# Altium project DC_AC_Converter.PrjPcb
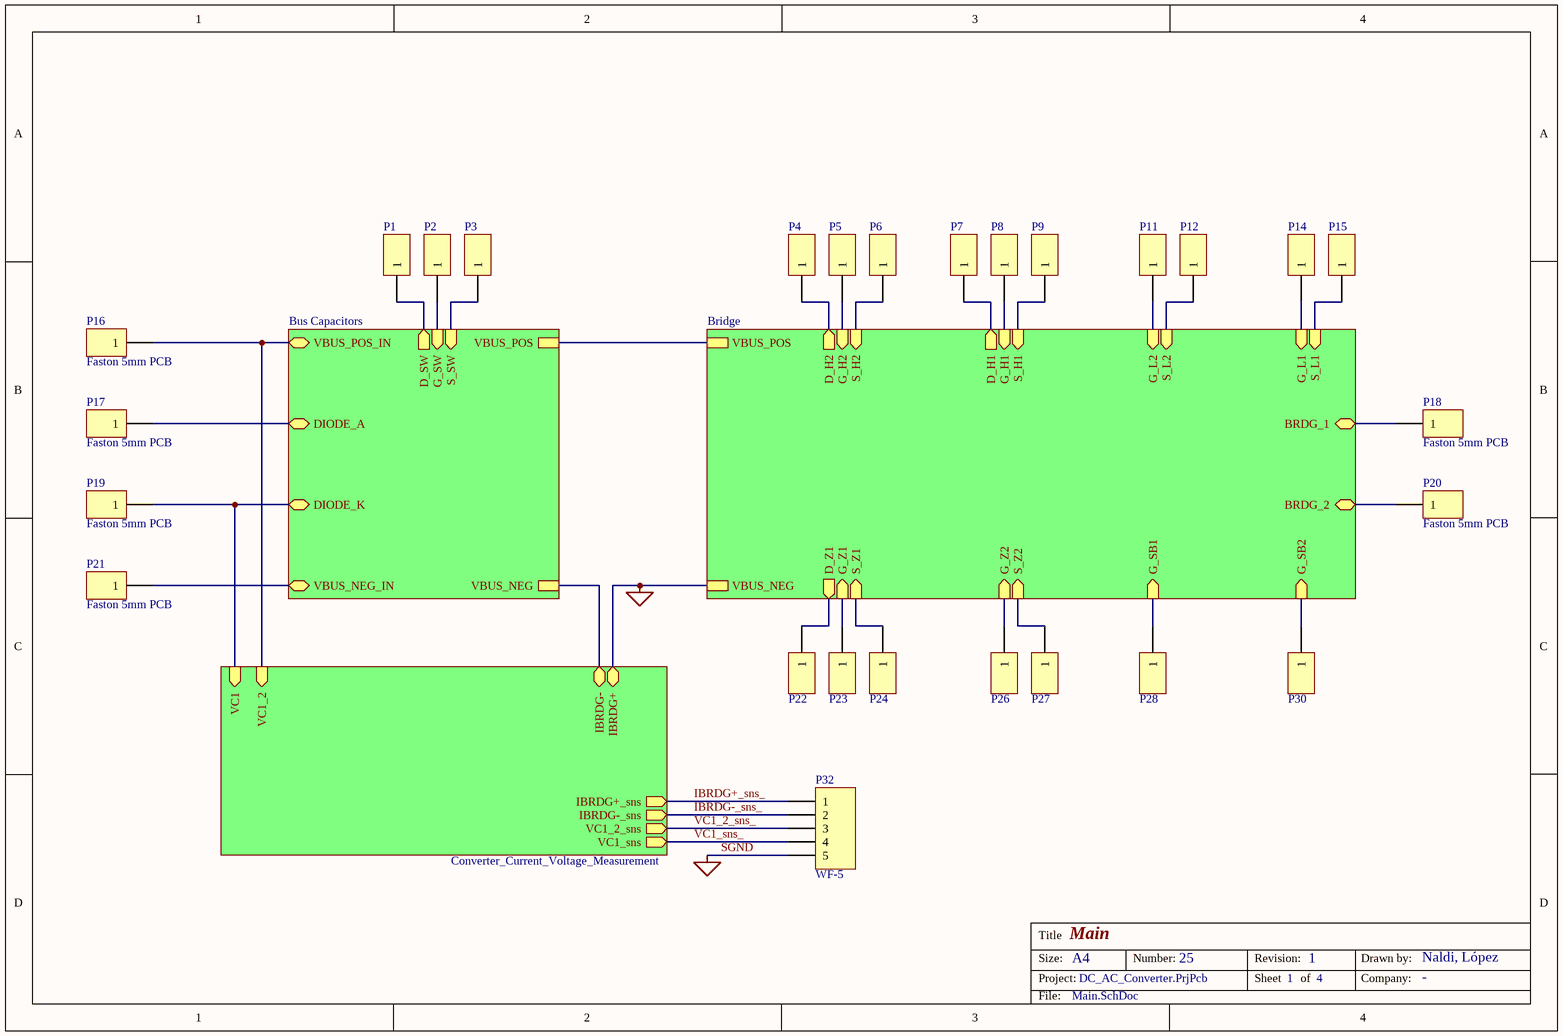
[diagram p0: Main.SchDoc]
4 sheets, 108 parts. Net scope: hierarchical (ports join the sheet entries above them; power ports are global).
Board file: DC_AC_Converter.PcbDoc
Sheets:
  Main.SchDoc
    Bus Capacitors = Bus_Capacitors.SchDoc
    Converter_Current_Voltage_Measurement = Converter_Current_Voltage_Measurement.SchDoc
    Bridge = Bridge.SchDoc

## Sheet Main.SchDoc: Main
size A4; CompanyName: -; DrawnBy: Naldi, López; Revision: 1; SheetNumber: 1; SheetTotal: 4; Number: 25

### Parts
P1  TS-101-T-AA  [SAMTEC TERMINAL/SOCKET STRIP 1 PIN new]  (value not drawn)
P2  TS-101-T-AA  [SAMTEC TERMINAL/SOCKET STRIP 1 PIN new]  (value not drawn)
P3  TS-101-T-AA  [SAMTEC TERMINAL/SOCKET STRIP 1 PIN new]  (value not drawn)
P4  TS-101-T-AA  [SAMTEC TERMINAL/SOCKET STRIP 1 PIN new]  (value not drawn)
P5  TS-101-T-AA  [SAMTEC TERMINAL/SOCKET STRIP 1 PIN new]  (value not drawn)
P6  TS-101-T-AA  [SAMTEC TERMINAL/SOCKET STRIP 1 PIN new]  (value not drawn)
P7  TS-101-T-AA  [SAMTEC TERMINAL/SOCKET STRIP 1 PIN new]  (value not drawn)
P8  TS-101-T-AA  [SAMTEC TERMINAL/SOCKET STRIP 1 PIN new]  (value not drawn)
P9  TS-101-T-AA  [SAMTEC TERMINAL/SOCKET STRIP 1 PIN new]  (value not drawn)
P11  TS-101-T-AA  [SAMTEC TERMINAL/SOCKET STRIP 1 PIN new]  (value not drawn)
P12  TS-101-T-AA  [SAMTEC TERMINAL/SOCKET STRIP 1 PIN new]  (value not drawn)
P14  TS-101-T-AA  [SAMTEC TERMINAL/SOCKET STRIP 1 PIN new]  (value not drawn)
P15  TS-101-T-AA  [SAMTEC TERMINAL/SOCKET STRIP 1 PIN new]  (value not drawn)
P16  Faston 5mm PCB  [FASTON 5mm PCB]
P17  Faston 5mm PCB  [FASTON 5mm PCB]
P18  Faston 5mm PCB  [FASTON 5mm PCB]
P19  Faston 5mm PCB  [FASTON 5mm PCB]
P20  Faston 5mm PCB  [FASTON 5mm PCB]
P21  Faston 5mm PCB  [FASTON 5mm PCB]
P22  TS-101-T-AA  [SAMTEC TERMINAL/SOCKET STRIP 1 PIN new]  (value not drawn)
P23  TS-101-T-AA  [SAMTEC TERMINAL/SOCKET STRIP 1 PIN new]  (value not drawn)
P24  TS-101-T-AA  [SAMTEC TERMINAL/SOCKET STRIP 1 PIN new]  (value not drawn)
P26  TS-101-T-AA  [SAMTEC TERMINAL/SOCKET STRIP 1 PIN new]  (value not drawn)
P27  TS-101-T-AA  [SAMTEC TERMINAL/SOCKET STRIP 1 PIN new]  (value not drawn)
P28  TS-101-T-AA  [SAMTEC TERMINAL/SOCKET STRIP 1 PIN new]  (value not drawn)
P30  TS-101-T-AA  [SAMTEC TERMINAL/SOCKET STRIP 1 PIN new]  (value not drawn)
P32  WF-5  [HDR1X5]

### Sub-sheets
Bridge = Bridge.SchDoc: BRDG_2 (bidir), BRDG_1 (bidir), VBUS_POS, VBUS_NEG, G_H2 (in), S_H2 (in), G_H1 (in), S_H1 (in), G_L2 (in), S_L2 (in), G_SB1 (in), G_SB2 (in), G_Z2 (in), S_Z2 (in), G_Z1 (in), S_Z1 (in), G_L1 (in), S_L1 (in), D_H2 (out), D_H1 (out), D_Z1 (out)
Bus Capacitors = Bus_Capacitors.SchDoc: VBUS_NEG, VBUS_POS, VBUS_POS_IN (bidir), DIODE_A (bidir), DIODE_K (bidir), VBUS_NEG_IN (bidir), G_SW (in), S_SW (in), D_SW (out)
Converter_Current_Voltage_Measurement = Converter_Current_Voltage_Measurement.SchDoc: VC1 (in), VC1_sns (out), IBRDG+_sns (out), VC1_2 (in), IBRDG- (bidir), IBRDG+ (bidir), VC1_2_sns (out), IBRDG-_sns (out)

### Nets
SGND: P12.1 P15.1 P32.5 ; sheet Converter_Current_Voltage_Measurement/IBRDG+, sheet Bridge/VBUS_NEG, sheet Bridge/S_L2, sheet Bridge/S_L1
IBRDG+_sns_: P32.1 ; sheet Converter_Current_Voltage_Measurement/IBRDG+_sns
IBRDG-_sns_: P32.2 ; sheet Converter_Current_Voltage_Measurement/IBRDG-_sns
VC1_2_sns_: P32.3 ; sheet Converter_Current_Voltage_Measurement/VC1_2_sns
VC1_sns_: P32.4 ; sheet Converter_Current_Voltage_Measurement/VC1_sns
NetC7_1: P4.1 P7.1 P16.1 ; sheet Bus Capacitors/VBUS_POS, sheet Bus Capacitors/VBUS_POS_IN, sheet Converter_Current_Voltage_Measurement/VC1_2, sheet Bridge/VBUS_POS, sheet Bridge/D_H2, sheet Bridge/D_H1
NetC7_3: P3.1 P17.1 ; sheet Bus Capacitors/DIODE_A, sheet Bus Capacitors/S_SW
NetC14_1: P1.1 P19.1 ; sheet Bus Capacitors/DIODE_K, sheet Bus Capacitors/D_SW, sheet Converter_Current_Voltage_Measurement/VC1
NetC14_3: P21.1 ; sheet Bus Capacitors/VBUS_NEG, sheet Bus Capacitors/VBUS_NEG_IN, sheet Converter_Current_Voltage_Measurement/IBRDG-
NetP2_1: P2.1 ; sheet Bus Capacitors/G_SW
NetP5_1: P5.1 ; sheet Bridge/G_H2
NetP6_1: P6.1 P20.1 P27.1 ; sheet Bridge/BRDG_2, sheet Bridge/S_H2, sheet Bridge/S_Z2
NetP8_1: P8.1 ; sheet Bridge/G_H1
NetP9_1: P9.1 P18.1 P24.1 ; sheet Bridge/BRDG_1, sheet Bridge/S_H1, sheet Bridge/S_Z1
NetP11_1: P11.1 ; sheet Bridge/G_L2
NetP14_1: P14.1 ; sheet Bridge/G_L1
NetP22_1: P22.1 ; sheet Bridge/D_Z1
NetP23_1: P23.1 ; sheet Bridge/G_Z1
NetP26_1: P26.1 ; sheet Bridge/G_Z2
NetP28_1: P28.1 ; sheet Bridge/G_SB1
NetP30_1: P30.1 ; sheet Bridge/G_SB2

### Notes on the sheet
- Title
- Size:
- Project:
- A4
- Number:
- Revision:
- Sheet
- of
- Drawn by:
- Company:
- File:

### Library data of the parts
P1-P9 P11 P12 P14 P15 P22-P24 P26-P28 P30 = TS-101-T-AA: Terminal Strip, 1-Pin, 2.54mm pitch; System: Connector; LatestRevisionDate: 17-Jul-2002; LatestRevisionNote: Re-released for DXP Platform.; Publisher: Altium Limited
P16-P21 = Faston 5mm PCB: System: Connector; LatestRevisionDate: 17-Jul-2002; LatestRevisionNote: Re-released for DXP Platform.; Publisher: Altium Limited
P32 = Header 5: Header, 5-Pin, 2.54mm pitch; System: Connector; LatestRevisionDate: 17-Jul-2002; LatestRevisionNote: Re-released for DXP Platform.; Publisher: Altium Limited

## Sheet Bus_Capacitors.SchDoc: Bus Capacitors
size A4; CompanyName: TM; DrawnBy: Juan Tinazzo; DocumentNumber: 1; Revision: 1; SheetNumber: 2; SheetTotal: 4; Number: 25
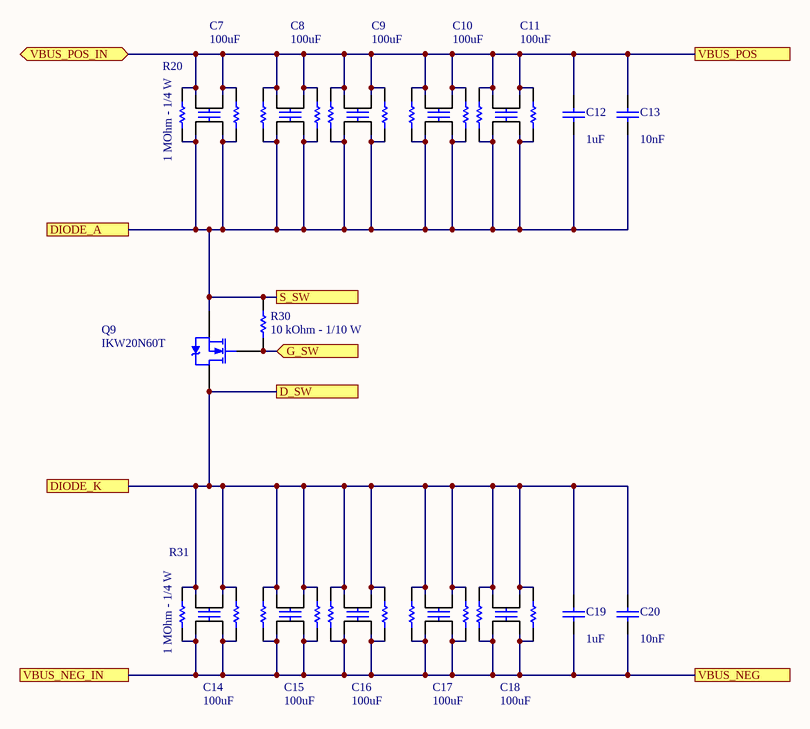
[diagram p1: Bus_Capacitors.SchDoc]

### Parts
C7  value 100uF  [MKP DC link - High density series]  (hidden comment: EPCOS B32778G4107)
C8  value 100uF  [MKP DC link - High density series]  (hidden comment: EPCOS B32778G4107)
C9  value 100uF  [MKP DC link - High density series]  (hidden comment: EPCOS B32778G4107)
C10  value 100uF  [MKP DC link - High density series]  (hidden comment: EPCOS B32778G4107)
C11  value 100uF  [MKP DC link - High density series]  (hidden comment: EPCOS B32778G4107)
C12  value 1uF  [MKP PITCH:27.5mm SIZE:13.5mmx31.5mm]  (hidden comment: EPCOS B32654A6105)
C13  value 10nF  [MKP PITCH:15mm SIZE:5mmx18mm]  (hidden comment: EPCOS B32652A0103)
C14  value 100uF  [MKP DC link - High density series]  (hidden comment: EPCOS B32778G4107)
C15  value 100uF  [MKP DC link - High density series]  (hidden comment: EPCOS B32778G4107)
C16  value 100uF  [MKP DC link - High density series]  (hidden comment: EPCOS B32778G4107)
C17  value 100uF  [MKP DC link - High density series]  (hidden comment: EPCOS B32778G4107)
C18  value 100uF  [MKP DC link - High density series]  (hidden comment: EPCOS B32778G4107)
C19  value 1uF  [MKP PITCH:27.5mm SIZE:13.5mmx31.5mm]  (hidden comment: EPCOS B32654A6105)
C20  value 10nF  [MKP PITCH:15mm SIZE:5mmx18mm]  (hidden comment: EPCOS B32652A0103)
Q9  IKW20N60T  [TO-247 Horiz. Heatsink]
R20  value 1 MOhm - 1/4 W  [RESC3216X60N]  (hidden comment: THT)
R21  THT  [RESC3216X60N]  (value not drawn)
R22  THT  [RESC3216X60N]  (value not drawn)
R23  THT  [RESC3216X60N]  (value not drawn)
R24  THT  [RESC3216X60N]  (value not drawn)
R25  THT  [RESC3216X60N]  (value not drawn)
R26  THT  [RESC3216X60N]  (value not drawn)
R27  THT  [RESC3216X60N]  (value not drawn)
R28  THT  [RESC3216X60N]  (value not drawn)
R29  THT  [RESC3216X60N]  (value not drawn)
R30  value 10 kOhm - 1/10 W  [RESC1608X50N]  (hidden comment: CRCW060310K0FKEA)
R31  value 1 MOhm - 1/4 W  [RESC3216X60N]  (hidden comment: THT)
R32  THT  [RESC3216X60N]  (value not drawn)
R33  THT  [RESC3216X60N]  (value not drawn)
R34  THT  [RESC3216X60N]  (value not drawn)
R35  THT  [RESC3216X60N]  (value not drawn)
R36  THT  [RESC3216X60N]  (value not drawn)
R37  THT  [RESC3216X60N]  (value not drawn)
R38  THT  [RESC3216X60N]  (value not drawn)
R39  THT  [RESC3216X60N]  (value not drawn)
R40  THT  [RESC3216X60N]  (value not drawn)

### Ports
D_SW, DIODE_A, DIODE_K, G_SW (in), S_SW, VBUS_NEG, VBUS_NEG_IN, VBUS_POS, VBUS_POS_IN (bidir)

### Nets
NetC7_1: C7.1 C7.2 C8.1 C8.2 C9.1 C9.2 C10.1 C10.2 C11.1 C11.2 C12.2 C13.1 R20.2 R21.2 R22.2 R23.2 R24.2 R25.2 R26.2 R27.2 R28.2 R29.2 ; port VBUS_POS_IN, port VBUS_POS
NetC7_3: C7.3 C7.4 C8.3 C8.4 C9.3 C9.4 C10.3 C10.4 C11.3 C11.4 C12.1 C13.2 Q9.3(S) R20.1 R21.1 R22.1 R23.1 R24.1 R25.1 R26.1 R27.1 R28.1 R29.1 R30.2 ; port DIODE_A, port S_SW
NetC14_1: C14.1 C14.2 C15.1 C15.2 C16.1 C16.2 C17.1 C17.2 C18.1 C18.2 C19.2 C20.2 Q9.2(D) R31.2 R32.2 R33.2 R34.2 R35.2 R36.2 R37.2 R38.2 R39.2 R40.2 ; port DIODE_K, port D_SW
NetC14_3: C14.3 C14.4 C15.3 C15.4 C16.3 C16.4 C17.3 C17.4 C18.3 C18.4 C19.1 C20.1 R31.1 R32.1 R33.1 R34.1 R35.1 R36.1 R37.1 R38.1 R39.1 R40.1 ; port VBUS_NEG, port VBUS_NEG_IN
NetP2_1: Q9.1(G) R30.1 ; port G_SW

### Notes on the sheet
- Title
- Size:
- Project:
- A4
- Number:
- Revision:
- Sheet
- of
- Drawn by:
- Company:
- File:

### Library data of the parts
C7-C11 C14-C18 = EPCOS B32778G4107: MKP DC link - High density series - 100uF 450V; Published: 8-Jun-2000; LatestRevisionDate: 17-Jul-2002; LatestRevisionNote: Re-released for DXP Platform.; PackageReference: RAD-0.3; Publisher: Altium Limited; PackageDescription: Radial Cap, Thru-Hole; 2 Leads; 0.3 in Pin Spacing
C12 C19 = EPCOS B32654A6105: MKP High pulse (wound) 1uF 630Vdc; Published: 8-Jun-2000; LatestRevisionDate: 17-Jul-2002; LatestRevisionNote: Re-released for DXP Platform.; PackageReference: RAD-0.3; Publisher: Altium Limited; PackageDescription: Radial Cap, Thru-Hole; 2 Leads; 0.3 in Pin Spacing
C13 C20 = EPCOS B32652A0103: MKP High pulse (wound) 10nF 1000Vdc; Published: 8-Jun-2000; LatestRevisionDate: 17-Jul-2002; LatestRevisionNote: Re-released for DXP Platform.; PackageReference: RAD-0.3; Publisher: Altium Limited; PackageDescription: Radial Cap, Thru-Hole; 2 Leads; 0.3 in Pin Spacing
Q9 = IPx65R110CFD: IGBTs LOW LOSS DuoPack 600V 20A; Published: 17-Sep-2003; DatasheetVersion: 13-Jul-2001; PackageVersion: 16-Sep-2002; PackageReference: SMD-0.5; Publisher: Altium Limited; PackageDescription: SM; 3 Leadless Terminals; Body 10.28 x 7.64 x 3.06 mm (LxWxH); ComponentLink1Description: Manufacturer Link; ComponentLink1URL: http://www.irf.com/; ComponentLink2Description: Datasheet; ComponentLink2URL: http://www.irf.com/product-info/datasheets/data/IRHN7150.pdf
R20 R31 = CRCW1206220KFKEA: Resistor; Manufacturer_Name: Vishay; Datasheet Link: http://www.vishay.com/docs/20035/dcrcwe3.pdf; Height: 0.6mm; Manufacturer_Part_Number: THT; Mouser Part Number: 71-CRCW1206-220K-E3; Mouser Price/Stock: https://www.mouser.co.uk/ProductDetail/Vishay-Dale/CRCW1206220KFKEA?qs=bSMkur10BccuQYiNrhxgBA%3D%3D
R21-R29 R32-R40 = CRCW1206220KFKEA: Resistor; Manufacturer_Name: Vishay; Value: 1 MOhm - 1/4 W; Datasheet Link: http://www.vishay.com/docs/20035/dcrcwe3.pdf; Height: 0.6mm; Manufacturer_Part_Number: THT; Mouser Part Number: 71-CRCW1206-220K-E3; Mouser Price/Stock: https://www.mouser.co.uk/ProductDetail/Vishay-Dale/CRCW1206220KFKEA?qs=bSMkur10BccuQYiNrhxgBA%3D%3D
R30 = CRCW060310K0FKEA: Resistor; Manufacturer_Name: Vishay; Datasheet Link: http://www.vishay.com/docs/20035/dcrcwe3.pdf; Height: 0.5mm; Manufacturer_Part_Number: CRCW060310K0FKEA; Mouser Part Number: 71-CRCW0603-10K-E3; Mouser Price/Stock: https://www.mouser.co.uk/ProductDetail/Vishay-Dale/CRCW060310K0FKEA?qs=pAO1Z172M84BVnhDjtnsoQ%3D%3D; Arrow Part Number: CRCW060310K0FKEA; Arrow Price/Stock: https://www.arrow.com/en/products/crcw060310k0fkea/vishay?region=nac

## Sheet Converter_Current_Voltage_Measurement.SchDoc: Current - Voltage Measurement
size A4; CompanyName: -; DrawnBy: Naldi, López; Revision: 1; SheetNumber: 4; SheetTotal: 4; Number: 25
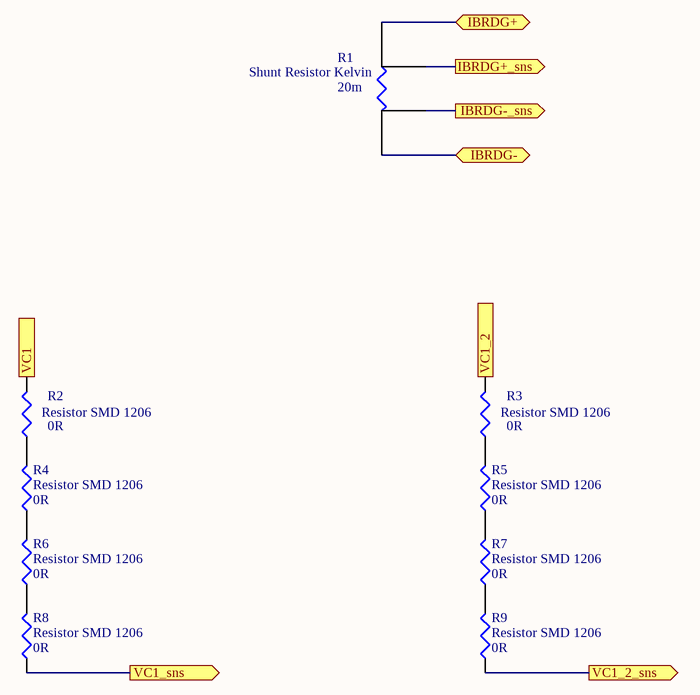
[diagram p2: Converter_Current_Voltage_Measurement.SchDoc]

### Parts
R1  Shunt Resistor Kelvin  value 20m  [Chip2PinSM127P600-8N]
R2  Resistor SMD 1206  value 0R  [RESC3116X07N - 1206]
R3  Resistor SMD 1206  value 0R  [RESC3116X07N - 1206]
R4  Resistor SMD 1206  value 0R  [RESC3116X07N - 1206]
R5  Resistor SMD 1206  value 0R  [RESC3116X07N - 1206]
R6  Resistor SMD 1206  value 0R  [RESC3116X07N - 1206]
R7  Resistor SMD 1206  value 0R  [RESC3116X07N - 1206]
R8  Resistor SMD 1206  value 0R  [RESC3116X07N - 1206]
R9  Resistor SMD 1206  value 0R  [RESC3116X07N - 1206]

### Ports
IBRDG+ (bidir), IBRDG+_sns (out), IBRDG- (bidir), IBRDG-_sns (out), VC1 (in), VC1_2 (in), VC1_2_sns (out), VC1_sns (out)

### Nets
SGND: R1.1 ; port IBRDG+
IBRDG+_sns_: R1.2 ; port IBRDG+_sns
IBRDG-_sns_: R1.3 ; port IBRDG-_sns
VC1_2_sns_: R9.1 ; port VC1_2_sns
VC1_sns_: R8.1 ; port VC1_sns
NetC7_1: R3.2 ; port VC1_2
NetC14_1: R2.2 ; port VC1
NetC14_3: R1.4 ; port IBRDG-
NetR2_1: R2.1 R4.2
NetR3_1: R3.1 R5.2
NetR4_1: R4.1 R6.2
NetR5_1: R5.1 R7.2
NetR6_1: R6.1 R8.2
NetR7_1: R7.1 R9.2

### Notes on the sheet
- Title
- Size:
- Project:
- A4
- Number:
- Revision:
- Sheet
- of
- Drawn by:
- Company:
- File:

### Library data of the parts
R1 = Shunt Resistor Kelvin: Published: 8-Jun-2000; LatestRevisionDate: 29-May-2009; LatestRevisionNote: IPC-7351 Footprint Added.; PackageReference: J1-0603; Publisher: Altium Limited; PackageDescription: Chip Resistor
R2-R9 = Resistor SMD 1206: Published: 8-Jun-2000; LatestRevisionDate: 29-May-2009; LatestRevisionNote: IPC-7351 Footprint Added.; PackageReference: J1-0603; Publisher: Altium Limited; PackageDescription: Chip Resistor

## Sheet Bridge.SchDoc: Bridge
size A4; CompanyName: TM; DrawnBy: Juan Tinazzo; DocumentNumber: 1; Revision: 1.1; SheetNumber: 3; SheetTotal: 4; SPICEModelCacheWSSKQKTY: <root> / <DocumentId>WSSKQKTY</DocumentId> / <CacheFrame Number="0"> / <Model Name="diode" Kind="MDL"> / <Text>*Default Diode / *Diode Pinout: A,K / .MODEL DIODE D()</Text> / </Model> / <Model Name="zener" Kind="MDL"> / <Text>*ZENER / *Default Zener 10V @ 10mA / *Zener Diode Pinout: A,K / .MODEL ZENER D( BV=10 IBV=10E-3 )</Text> / </Model> / </CacheFrame> / </root>; Number: 25
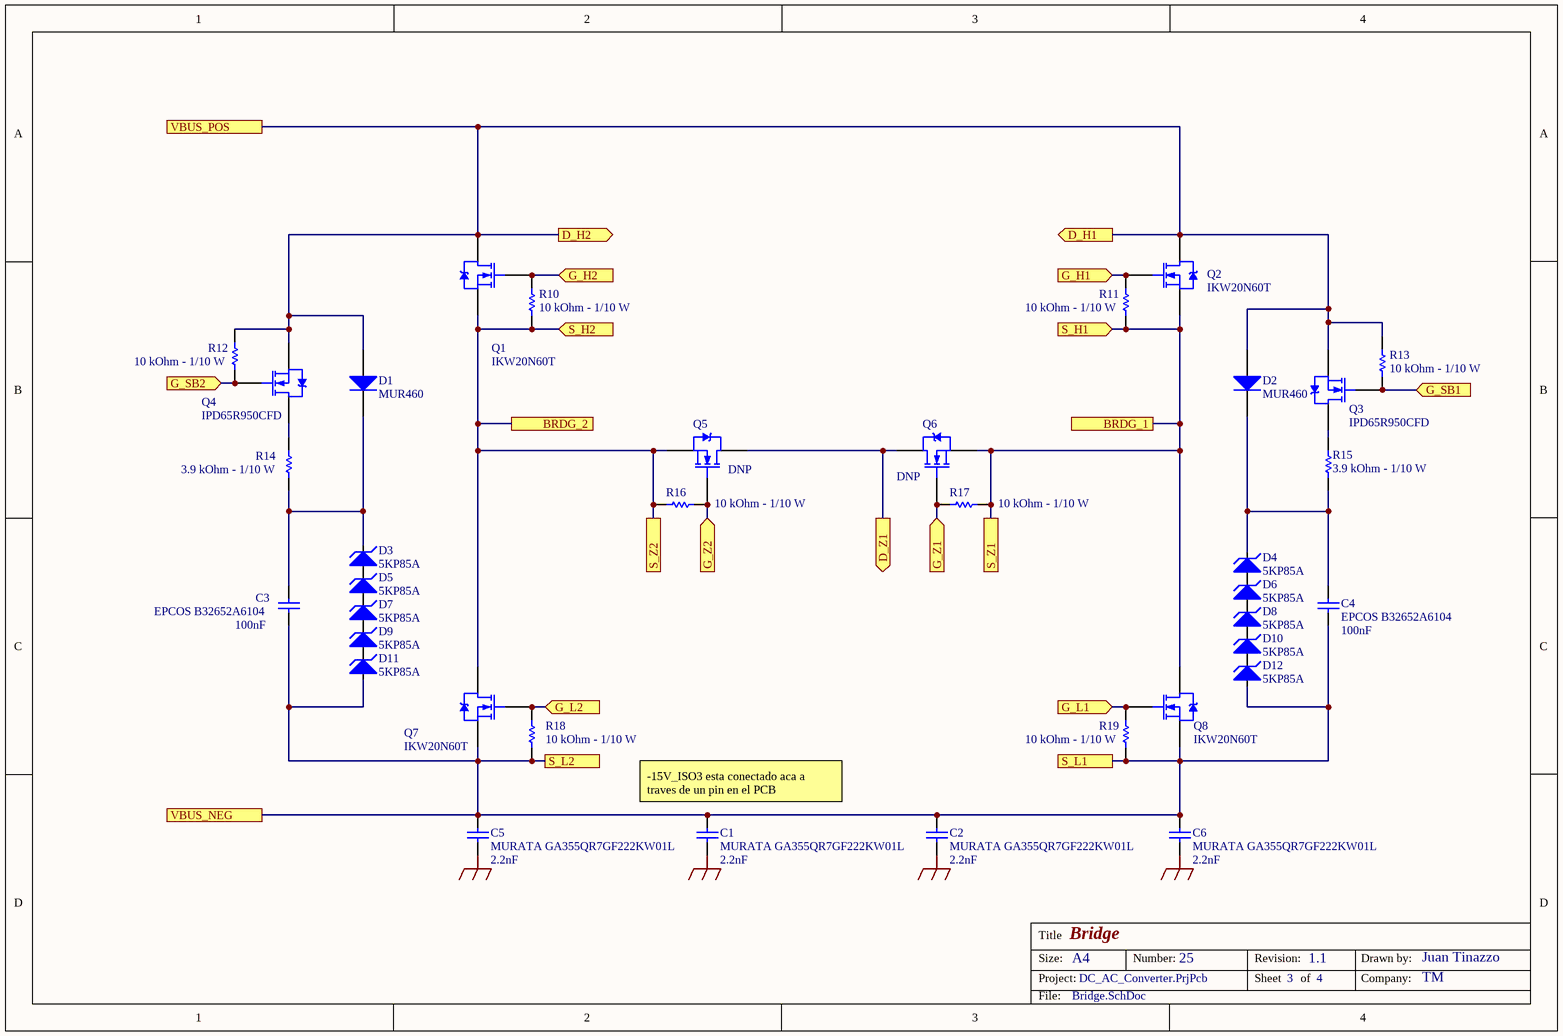
[diagram p3: Bridge.SchDoc]

### Parts
C1  MURATA GA355QR7GF222KW01L  value 2.2nF  [Chip2PinSM127P600-8N_safety]
C2  MURATA GA355QR7GF222KW01L  value 2.2nF  [Chip2PinSM127P600-8N_safety]
C3  EPCOS B32652A6104  value 100nF  [MKP  pitch:15mm size:7mm x 18mm]
C4  EPCOS B32652A6104  value 100nF  [MKP  pitch:15mm size:7mm x 18mm]
C5  MURATA GA355QR7GF222KW01L  value 2.2nF  [Chip2PinSM127P600-8N_safety]
C6  MURATA GA355QR7GF222KW01L  value 2.2nF  [Chip2PinSM127P600-8N_safety]
D1  MUR460  [SMC]
D2  MUR460  [SMC]
D3  5KP85A  [DIODE-0.7]
D4  5KP85A  [DIODE-0.7]
D5  5KP85A  [DIODE-0.7]
D6  5KP85A  [DIODE-0.7]
D7  5KP85A  [DIODE-0.7]
D8  5KP85A  [DIODE-0.7]
D9  5KP85A  [DIODE-0.7]
D10  5KP85A  [DIODE-0.7]
D11  5KP85A  [DIODE-0.7]
D12  5KP85A  [DIODE-0.7]
Q1  IKW20N60T  [TO-247 Horiz. Heatsink]
Q2  IKW20N60T  [TO-247 Horiz. Heatsink]
Q3  IPD65R950CFD  [DPAK229P994X241-3N]
Q4  IPD65R950CFD  [DPAK229P994X241-3N]
Q5  DNP  [TO-247 Horiz. Heatsink]
Q6  DNP  [TO-247 Horiz. Heatsink]
Q7  IKW20N60T  [TO-247 Horiz. Heatsink]
Q8  IKW20N60T  [TO-247 Horiz. Heatsink]
R10  value 10 kOhm - 1/10 W  [RESC1608X50N]  (hidden comment: CRCW060310K0FKEA)
R11  value 10 kOhm - 1/10 W  [RESC1608X50N]  (hidden comment: CRCW060310K0FKEA)
R12  value 10 kOhm - 1/10 W  [RESC1608X50N]  (hidden comment: CRCW060310K0FKEA)
R13  value 10 kOhm - 1/10 W  [RESC1608X50N]  (hidden comment: CRCW060310K0FKEA)
R14  value 3.9 kOhm - 1/10 W  [RESC1608X50N]  (hidden comment: CRCW060310K0FKEA)
R15  value 3.9 kOhm - 1/10 W  [RESC1608X50N]  (hidden comment: CRCW060310K0FKEA)
R16  value 10 kOhm - 1/10 W  [RESC1608X50N]  (hidden comment: CRCW060310K0FKEA)
R17  value 10 kOhm - 1/10 W  [RESC1608X50N]  (hidden comment: CRCW060310K0FKEA)
R18  value 10 kOhm - 1/10 W  [RESC1608X50N]  (hidden comment: CRCW060310K0FKEA)
R19  value 10 kOhm - 1/10 W  [RESC1608X50N]  (hidden comment: CRCW060310K0FKEA)

### Ports
BRDG_1, BRDG_2, D_H1 (out), D_H2 (out), D_Z1 (out), G_H1 (in), G_H2 (in), G_L1 (in), G_L2 (in), G_SB1 (in), G_SB2 (in), G_Z1 (in), G_Z2 (in), S_H1 (in), S_H2 (in), S_L1, S_L2, S_Z1, S_Z2, VBUS_NEG, VBUS_POS

### Nets
EARTH: C1.1 C2.1 C5.1 C6.1
SGND: C1.2 C2.2 C3.1 C4.1 C5.2 C6.2 D11.1(A) D12.1(A) Q7.3(S) Q8.3(S) R18.1 R19.1 ; port VBUS_NEG, port S_L1, port S_L2
NetC3_2: C3.2 D1.2(K) D3.2(K) R14.2
NetC4_2: C4.2 D2.2(K) D4.2(K) R15.2
NetC7_1: D1.1(A) D2.1(A) Q1.2(D) Q2.2(D) Q3.3(S) Q4.3(S) R12.1 R13.2 ; port VBUS_POS, port D_H2, port D_H1
NetD3_1: D3.1(A) D5.2(K)
NetD4_1: D4.1(A) D6.2(K)
NetD5_1: D5.1(A) D7.2(K)
NetD6_1: D6.1(A) D8.2(K)
NetD7_1: D7.1(A) D9.2(K)
NetD8_1: D8.1(A) D10.2(K)
NetD9_1: D9.1(A) D11.2(K)
NetD10_1: D10.1(A) D12.2(K)
NetP5_1: Q1.1(G) R10.2 ; port G_H2
NetP6_1: Q1.3(S) Q5.3(S) Q7.2(D) R10.1 R16.2 ; port BRDG_2, port S_H2, port S_Z2
NetP8_1: Q2.1(G) R11.2 ; port G_H1
NetP9_1: Q2.3(S) Q6.3(S) Q8.2(D) R11.1 R17.1 ; port BRDG_1, port S_H1, port S_Z1
NetP11_1: Q7.1(G) R18.2 ; port G_L2
NetP14_1: Q8.1(G) R19.2 ; port G_L1
NetP22_1: Q5.2(D) Q6.2(D) ; port D_Z1
NetP23_1: Q6.1(G) R17.2 ; port G_Z1
NetP26_1: Q5.1(G) R16.1 ; port G_Z2
NetP28_1: Q3.1(G) R13.1 ; port G_SB1
NetP30_1: Q4.1(G) R12.2 ; port G_SB2
NetQ3_2: Q3.2(D) R15.1
NetQ4_2: Q4.2(D) R14.1

### Notes on the sheet
- (near C1) -15V_ISO3 esta conectado aca a traves de un pin en el PCB
- Title
- Size:
- Project:
- A4
- Number:
- Revision:
- Sheet
- of
- Drawn by:
- Company:
- File:

### Library data of the parts
C1 C2 C5 C6 = MURATA GA355QR7GF222KW01L: Safety Standard Certified Ceramic Y2 2.2nF 250Vac; Published: 8-Jun-2000; LatestRevisionDate: 17-Jul-2002; LatestRevisionNote: Re-released for DXP Platform.; PackageReference: RAD-0.3; Publisher: Altium Limited; PackageDescription: Radial Cap, Thru-Hole; 2 Leads; 0.3 in Pin Spacing
C3 C4 = EPCOS B32652A6104: MKP High pulse (wound) 100nF 630Vdc; Published: 8-Jun-2000; LatestRevisionDate: 17-Jul-2002; LatestRevisionNote: Re-released for DXP Platform.; PackageReference: RAD-0.3; Publisher: Altium Limited; PackageDescription: Radial Cap, Thru-Hole; 2 Leads; 0.3 in Pin Spacing
D1 D2 = Diode: Default Diode; Published: 8-Jun-2000; LatestRevisionDate: 17-Jul-2002; LatestRevisionNote: Re-released for DXP Platform.; PackageVersion: Sep-1996; PackageReference: SMC; Publisher: Altium Limited; PackageDescription: DO-214-AB/SMC; 2 C-Bend Leads; Body 7.9 x 5.9 mm, inc. leads (LxW); Code_JEDEC: DO-214-AB
D3-D12 = D Zener: Zener Diode; Published: 8-Jun-2000; LatestRevisionDate: 17-Jul-2002; LatestRevisionNote: Re-released for DXP Platform.; PackageReference: DIODE-0.7; Publisher: Altium Limited; PackageDescription: Diode, Thru-Hole; 2 Leads; 0.7 in Pin Spacing
Q1 Q2 Q5-Q8 = IPx65R110CFD: IGBTs LOW LOSS DuoPack 600V 20A; Published: 17-Sep-2003; DatasheetVersion: 13-Jul-2001; PackageVersion: 16-Sep-2002; PackageReference: SMD-0.5; Publisher: Altium Limited; PackageDescription: SM; 3 Leadless Terminals; Body 10.28 x 7.64 x 3.06 mm (LxWxH); ComponentLink1Description: Manufacturer Link; ComponentLink1URL: http://www.irf.com/; ComponentLink2Description: Datasheet; ComponentLink2URL: http://www.irf.com/product-info/datasheets/data/IRHN7150.pdf
Q3 Q4 = IPD65R950CFD: MOSFET N-Ch 700V 3.9A DPAK-2 /; Published: 17-Sep-2003; DatasheetVersion: 13-Jul-2001; PackageVersion: 16-Sep-2002; PackageReference: SMD-0.5; Publisher: Altium Limited; PackageDescription: SM; 3 Leadless Terminals; Body 10.28 x 7.64 x 3.06 mm (LxWxH); ComponentLink1Description: Manufacturer Link; ComponentLink1URL: http://www.irf.com/; ComponentLink2Description: Datasheet; ComponentLink2URL: http://www.irf.com/product-info/datasheets/data/IRHN7150.pdf
R10-R13 R16-R19 = CRCW060310K0FKEA: Resistor; Manufacturer_Name: Vishay; Datasheet Link: http://www.vishay.com/docs/20035/dcrcwe3.pdf; Height: 0.5mm; Manufacturer_Part_Number: CRCW060310K0FKEA; Mouser Part Number: 71-CRCW0603-10K-E3; Mouser Price/Stock: https://www.mouser.co.uk/ProductDetail/Vishay-Dale/CRCW060310K0FKEA?qs=pAO1Z172M84BVnhDjtnsoQ%3D%3D; Arrow Part Number: CRCW060310K0FKEA; Arrow Price/Stock: https://www.arrow.com/en/products/crcw060310k0fkea/vishay?region=nac
R14 R15 = CRCW060310K0FKEA: Resistor; Manufacturer_Name: Vishay; Manufacturer_Part_Number: CRCW06033K90FKEA; Datasheet Link: http://www.vishay.com/docs/20035/dcrcwe3.pdf; Height: 0.5mm; Mouser Part Number: 71-CRCW0603-10K-E3; Mouser Price/Stock: https://www.mouser.co.uk/ProductDetail/Vishay-Dale/CRCW060310K0FKEA?qs=pAO1Z172M84BVnhDjtnsoQ%3D%3D; Arrow Part Number: CRCW060310K0FKEA; Arrow Price/Stock: https://www.arrow.com/en/products/crcw060310k0fkea/vishay?region=nac

## Nets that join several sheets
SGND: Main (P12.1 P15.1 P32.5), Converter_Current_Voltage_Measurement (R1.1), Bridge (12 pins)
IBRDG+_sns_: Main (P32.1), Converter_Current_Voltage_Measurement (R1.2)
IBRDG-_sns_: Main (P32.2), Converter_Current_Voltage_Measurement (R1.3)
NetC7_1: Main (P4.1 P7.1 P16.1), Bus_Capacitors (22 pins), Converter_Current_Voltage_Measurement (R3.2), Bridge (8 pins)
NetC7_3: Main (P3.1 P17.1), Bus_Capacitors (24 pins)
NetC14_1: Main (P1.1 P19.1), Bus_Capacitors (23 pins), Converter_Current_Voltage_Measurement (R2.2)
NetC14_3: Main (P21.1), Bus_Capacitors (22 pins), Converter_Current_Voltage_Measurement (R1.4)
NetP2_1: Main (P2.1), Bus_Capacitors (Q9.1 R30.1)
NetP5_1: Main (P5.1), Bridge (Q1.1 R10.2)
NetP6_1: Main (P6.1 P20.1 P27.1), Bridge (5 pins)
NetP8_1: Main (P8.1), Bridge (Q2.1 R11.2)
NetP9_1: Main (P9.1 P18.1 P24.1), Bridge (5 pins)
NetP11_1: Main (P11.1), Bridge (Q7.1 R18.2)
NetP14_1: Main (P14.1), Bridge (Q8.1 R19.2)
NetP22_1: Main (P22.1), Bridge (Q5.2 Q6.2)
NetP23_1: Main (P23.1), Bridge (Q6.1 R17.2)
NetP26_1: Main (P26.1), Bridge (Q5.1 R16.1)
NetP28_1: Main (P28.1), Bridge (Q3.1 R13.1)
NetP30_1: Main (P30.1), Bridge (Q4.1 R12.2)
VC1_2_sns_: Main (P32.3), Converter_Current_Voltage_Measurement (R9.1)
VC1_sns_: Main (P32.4), Converter_Current_Voltage_Measurement (R8.1)